# Altium schematic sheet ESP_Grow_Main_Rev_B_0_Title.SchDoc
size A
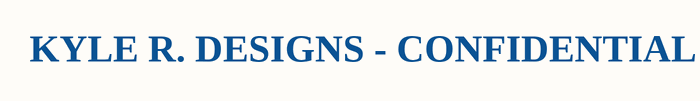
[diagram p0: ESP_Grow_Main_Rev_B_0_Title.SchDoc]

## Notes on the sheet
- KYLE R. DESIGNS - CONFIDENTIAL